# Altium project PCB_Project_AdapterBoard_GaN.PrjPcb
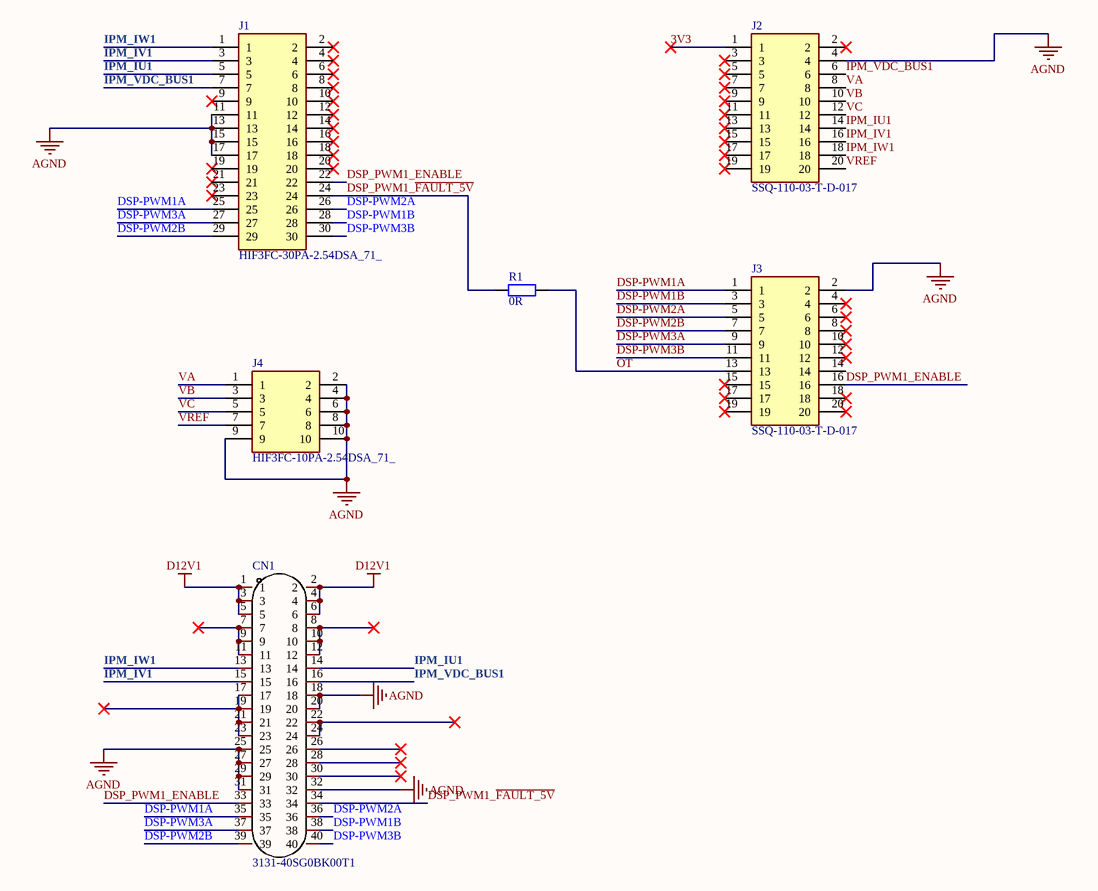
[diagram p0: PCBProject_AdapterBoard_GaN.SchDoc]
1 sheet, 6 parts. Net scope: global (net labels, ports and power ports of the same name join across sheets).
Board file: PCBProject_AdapterBoard_GaN.PcbDoc

## Sheet PCBProject_AdapterBoard_GaN.SchDoc
size A4

### Parts
CN1  3131-40SG0BK00T1  [IDC-TH_3131-40SG0BK00T1]
J1  HIF3FC-30PA-2.54DSA_71_  [SHDR30W50P254_2X15_4560X850X1200P]
J2  SSQ-110-03-T-D-017  [RHDR20W64P254_2X10_2591X495X851P]
J3  SSQ-110-03-T-D-017  [RHDR20W64P254_2X10_2591X495X851P]
J4  HIF3FC-10PA-2.54DSA_71_  [SHDR10W50P254_2X5_2020X850X920P]
R1  0R  [0805]

### Nets
AGND: CN1.18 CN1.20 CN1.25 CN1.27 CN1.29 CN1.31 CN1.32 J1.11 J1.13 J1.15 J1.17 J2.4 J3.2 J4.2 J4.4 J4.6 J4.8 J4.9 J4.10
D12V1: CN1.1 CN1.2 CN1.3 CN1.4 CN1.5 CN1.6
3V3: J2.1
DSP-PWM1A: CN1.35 J1.25 J3.1
DSP-PWM1B: CN1.38 J1.28 J3.3
DSP-PWM2A: CN1.36 J1.26 J3.5
DSP-PWM2B: CN1.39 J1.29 J3.7
DSP-PWM3A: CN1.37 J1.27 J3.9
DSP-PWM3B: CN1.40 J1.30 J3.11
DSP_PWM1_ENABLE: CN1.33 J1.22 J3.16
DSP_PWM1_~{FAULT_5V}: CN1.34 J1.24 R1.1
IPM_IU1: CN1.14 J1.5 J2.14
IPM_IV1: CN1.15 J1.3 J2.16
IPM_IW1: CN1.13 J1.1 J2.18
IPM_VDC_BUS1: CN1.16 J1.7 J2.6
OT: J3.13 R1.2
VA: J2.8 J4.1
VB: J2.10 J4.3
VC: J2.12 J4.5
VREF: J2.20 J4.7
NetCN1_7: CN1.7 CN1.9 CN1.11
NetCN1_8: CN1.8 CN1.10 CN1.12
NetCN1_17: CN1.17 CN1.19 CN1.21 CN1.23
NetCN1_22: CN1.22 CN1.24

Not connected (* = marked no-connect by the designer): CN1 26* 28* 30*; J1 2* 4* 6* 8* 9* 10* 12* 14* 16* 18* 19* 20* 21* 23*; J2 2* 3* 5* 7* 9* 11* 13* 15* 17* 19*; J3 4* 6* 8* 10* 12* 14 15* 17* 18* 19* 20*

### Library data of the parts
CN1 = 3131-40SG0BK00T1: 连接器类型:简牛座;每排PIN数:20;排数:2;间距:1.27mm;行距:1.27mm;封装形式:直插;触头材质:黄铜;触头镀层:金;; Manufacturer: Wcon(维峰电子); Add into BOM: yes; Connector Type: 简牛座; Pin Number in each Row: 20; Pitch: 1.27mm; Holder Type: 直插; Name: 3131-40SG0BK00T1; Symbol: 3131-40SG0BK00T1; Device: 3131-40SG0BK00T1; LCSC Part Name: 每排P数:20 排数:2 1.27mm; Supplier Part: C976754; Manufacturer Part: 3131-40SG0BK00T1; Supplier Footprint: 插件,P=1.27mm; JLCPCB Part Class: Extended Part; Datasheet: https://atta.szlcsc.com/upload/public/pdf/source/20210304/C976754_BF257D3FF426E047B764690466F062CF.pdf; Supplier: LCSC; Convert to PCB: yes; Number of Rows: 2; Row Spacing: 1.27mm; Contact Material: 黄铜; Contact Plating: 金
J1 = HIF3FC-30PA-2.54DSA_71_: Connector; Manufacturer_Name: Hirose; Manufacturer_Part_Number: HIF3FC-30PA-2.54DSA(71); Datasheet Link: https://datasheet.datasheetarchive.com/originals/distributors/SFDatasheet-7/sf-000141320.pdf; Height: 12mm; Mouser Part Number: 798-HIF3FC30PA254D71; Mouser Price/Stock: https://www.mouser.co.uk/ProductDetail/Hirose-Connector/HIF3FC-30PA-254DSA71?qs=eDUdFcBPps32%2FyAdBVx6ww%3D%3D
J2 J3 = SSQ-110-03-T-D-017: Connector; Manufacturer_Name: SAMTEC; Datasheet Link: http://suddendocs.samtec.com/catalog_english/ssq_th.pdf; Height: 8.51mm; Manufacturer_Part_Number: SSQ-110-03-T-D-017
J4 = HIF3FC-10PA-2.54DSA_71_: Connector; Manufacturer_Name: Hirose; Manufacturer_Part_Number: HIF3FC-10PA-2.54DSA(71); Datasheet Link: https://componentsearchengine.com/Datasheets/1/HIF3FC-10PA-2.54DSA(71).pdf; Height: 9.2mm; Mouser Part Number: 798-HIF3FC10PA254D71; Mouser Price/Stock: https://www.mouser.co.uk/ProductDetail/Hirose-Connector/HIF3FC-10PA-2.54DSA71?qs=eDUdFcBPps26f2LJxn%252B8VA%3D%3D; System: Connector
R1 = Res2_5: Resistor; Value: 470R; Published: 8-Jun-2000; LatestRevisionDate: 17-Jul-2002; LatestRevisionNote: Re-released for DXP Platform.; PackageReference: AXIAL-0.4; Publisher: Altium Limited